# EasyEDA schematic Power Supply.json
TITLE: New Schematic; REV: 1.0; Date: 2018-09-01; Sheet: 1/1; Drawn By: tim.savage
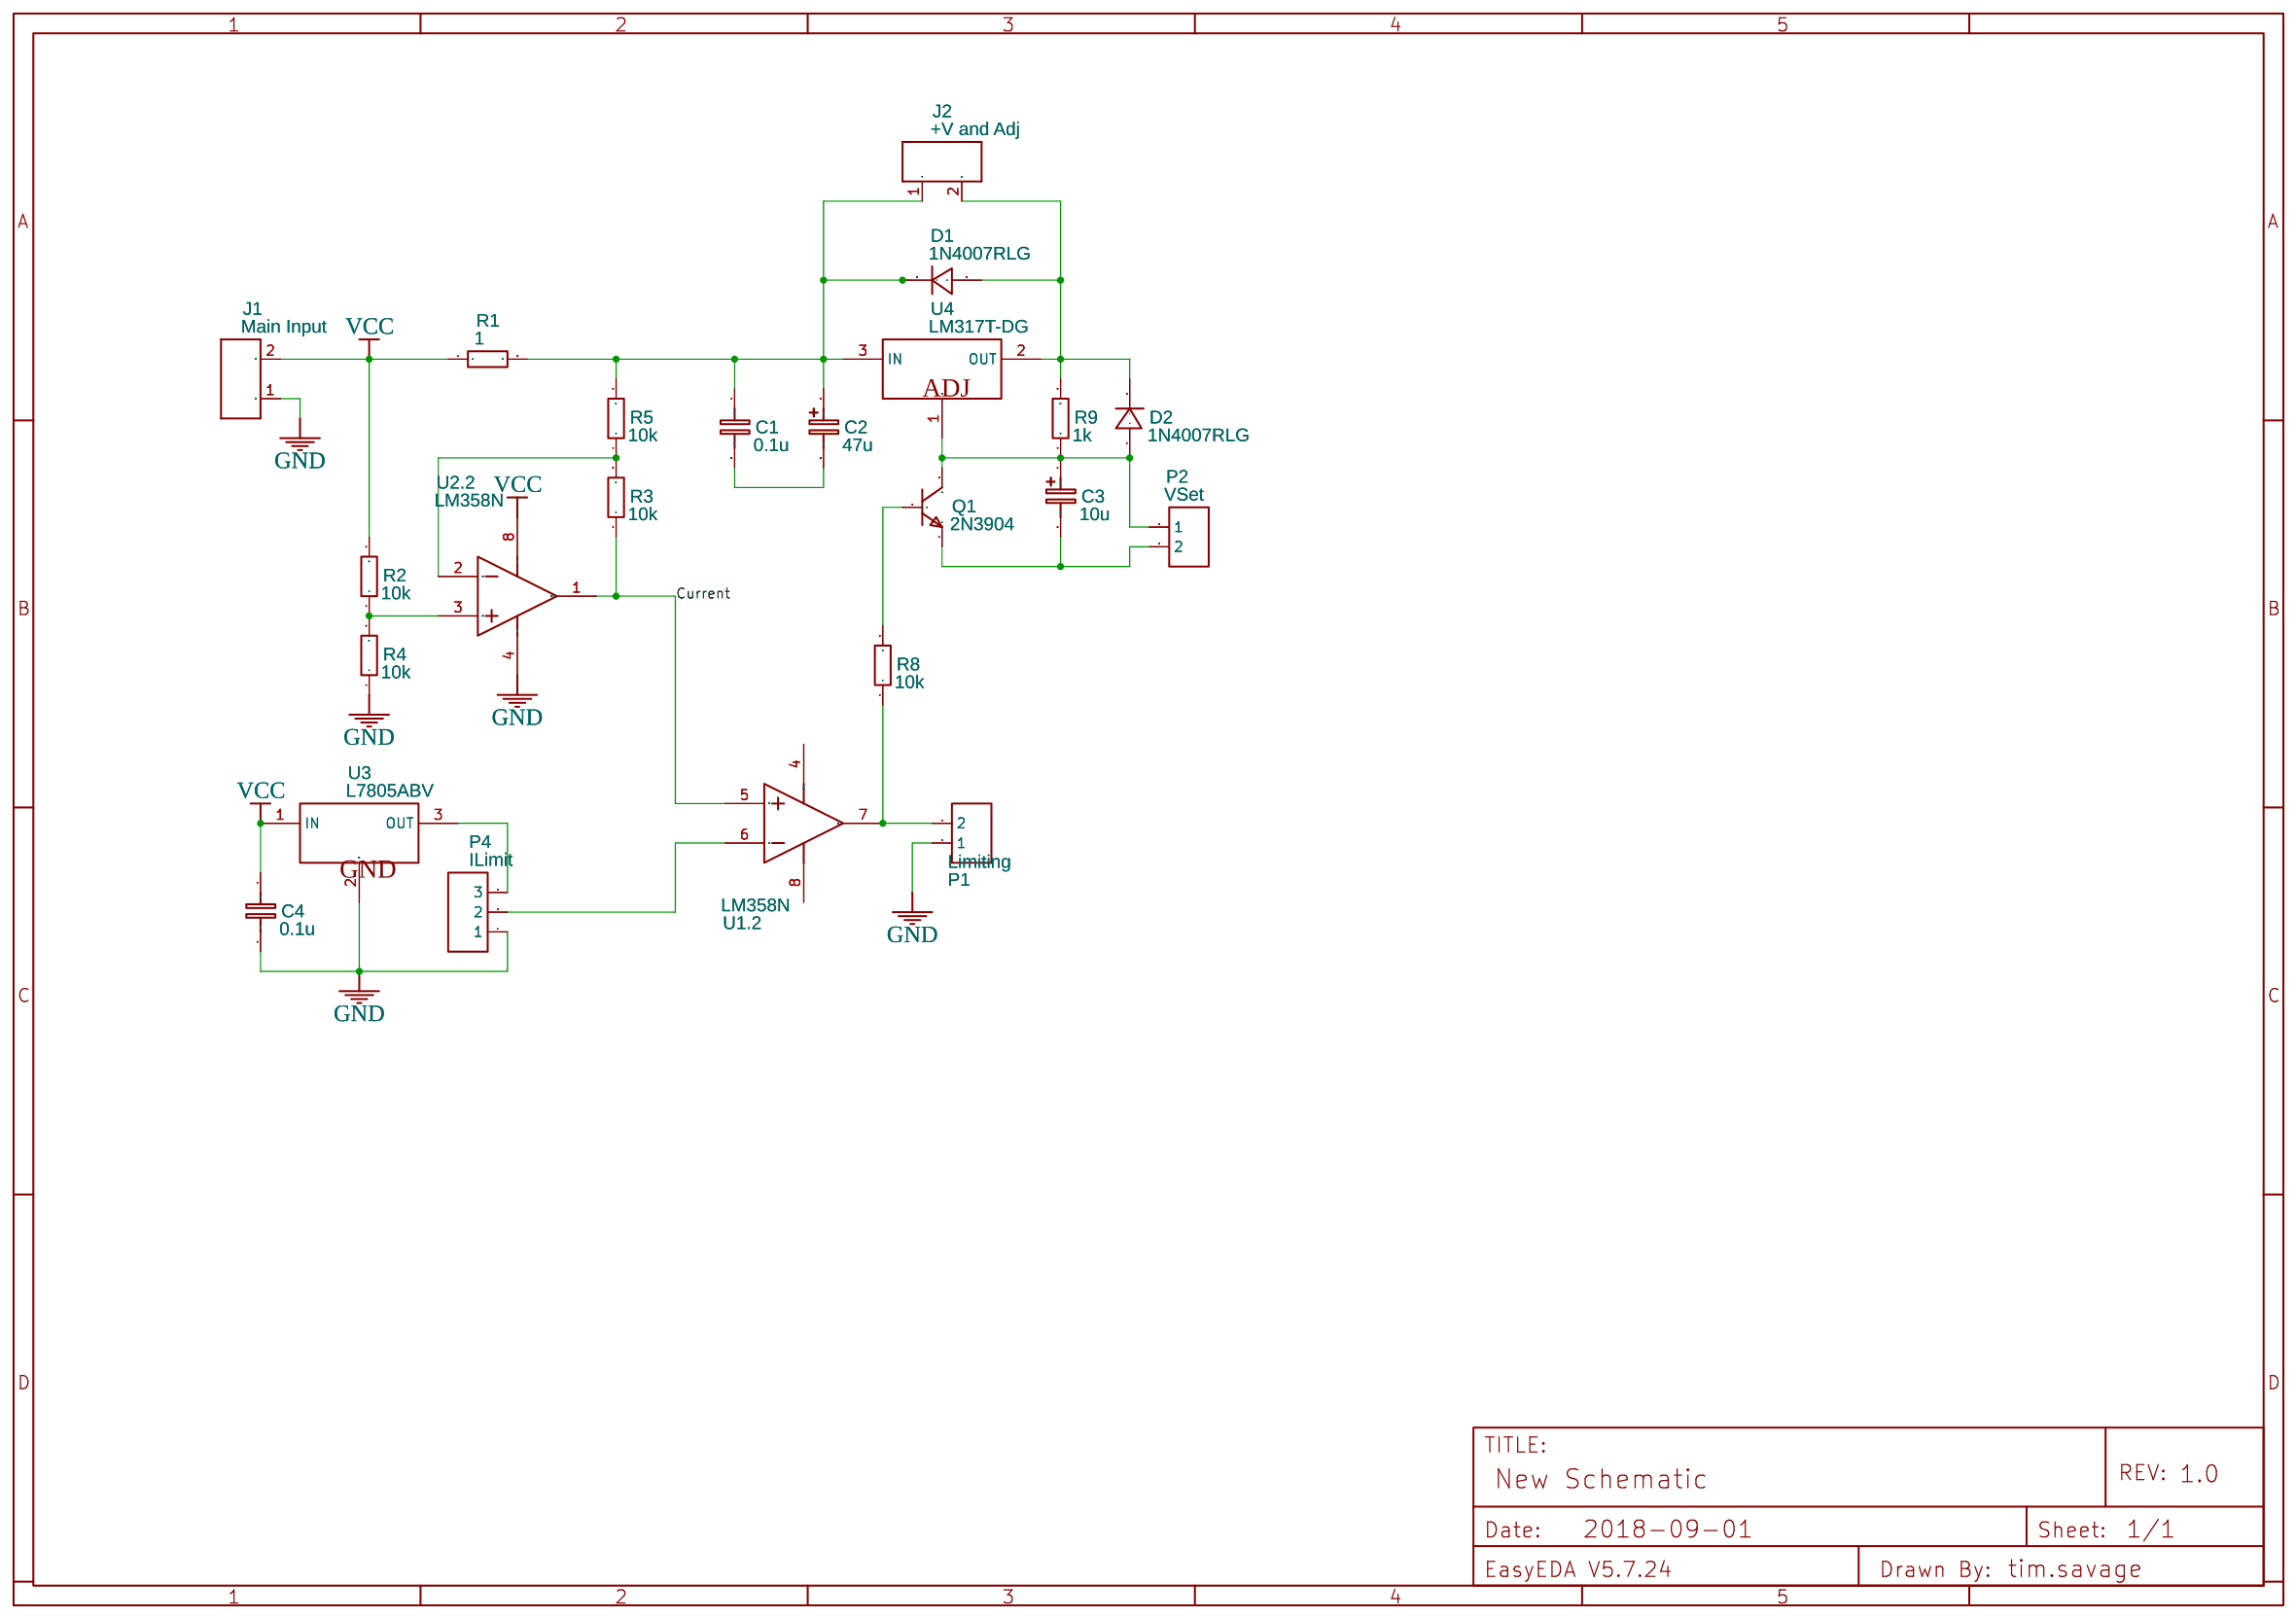
[diagram p0: schematic sheet]

## Parts
C1  0.1u  [RAD-0.1]
C2  47u  [CAP-D3.0XF1.5]
C3  10u  [CAP-D3.0XF1.5]
C4  0.1u  [RAD-0.1]
D1  1N4007RLG  [DO-41]
D2  1N4007RLG  [DO-41]
J1  Main Input  [H2-5.0-10.5X8.0MM]
J2  +V and Adj  [H2-5.0-10.5X8.0MM]
P1  Limiting  [HDR-1X2/2.54]
P2  VSet  [HDR-1X2/2.54]
P4  ILimit  [HDR-3X1/2.54]
Q1  2N3904  [TO-92(TO-92-3)]
R1  1  [AXIAL-0.3]
R2  10k  [AXIAL-0.3]
R3  10k  [AXIAL-0.3]
R4  10k  [AXIAL-0.3]
R5  10k  [AXIAL-0.3]
R8  10k  [AXIAL-0.3]
R9  1k  [AXIAL-0.3]
U1  LM358N  [DIP8]  (section 2)
U2  LM358N  [DIP8]  (section 2)
U3  L7805ABV  [TO-220(TO-220-3)]
U4  LM317T-DG  [TO-220(TO-220-3)]

## Library data of the parts
C1 C4 = Cap_RAD-0.1_EU: Manufacturer Part: ?
C2 C3 = Cap_Electrolytic(TH)_D3.0XF1.5_EU: Contributor: EasyEDA; Manufacturer Part: ?
D1 D2 = -: Supplier Part: C53568; Supplier: LCSC; Manufacturer: ON; image: //image.lceda.cn/szlcsc/C53568.jpg
J1 J2 = -: Screw Terminal; Manufacturer Part: ?
P1 P2 = -: Supplier Part: C49661; Supplier: LCSC; Manufacturer: BOOMELE; Manufacturer Part: 2.54-1*2PFemale; image: //image.lceda.cn/szlcsc/C49661.jpg
P4 = -: Supplier Part: C49257; Supplier: LCSC; Manufacturer: BOOMELE; Manufacturer Part: Header2.54mm 1*3P; image: //image.lceda.cn/szlcsc/C49257.jpg
Q1 = -: Supplier Part: C118538; Supplier: LCSC; Manufacturer: SEMTECH
R1-R5 R8 R9 = Res_AXIAL-0.3(1/8W)_EU: Manufacturer Part: ?
U1 = -: Low Power Dual Operational Amplifier, 8-pin MDIP; Manufacturer Part: ?
U2 = -: Low Power Dual Operational Amplifier, 8-pin MDIP; subpart_no: 2; Manufacturer Part: ?
U3 = -: Supplier Part: C16807; Supplier: LCSC; Manufacturer: STMicroelectronics; image: //image.lceda.cn/szlcsc/C16807.jpg
U4 = -: Supplier Part: C18718; Supplier: LCSC; Manufacturer: STMicroelectronics; image: //image.lceda.cn/szlcsc/C18718.jpg

## Nets
GND: C4.2 J1.1 P1.1 P4.1 R4.1 U2.4(GND) U3.2(GND)
VCC: C4.1 J1.2 R1.1 R2.2 U2.8(V+) U3.1(IN)
Current: R3.1 U1.5(INB+) U2.1(OUTA)
Net-(C1-1): C1.1 C2.1 D1.2(-) J2.1 R1.2 R5.2 U4.3(IN)
Net-(C1-2): C1.2 C2.2
Net-(C3-1): C3.1 D2.1(+) P2.1 Q1.3(C) R9.1 U4.1(ADJ)
Net-(C3-2): C3.2 P2.2 Q1.1(E)
Net-(D1-1): D1.1(+) D2.2(-) J2.2 R9.2 U4.2(OUT)
Net-(P1-2): P1.2 R8.1 U1.7(OUTB)
Net-(P4-2): P4.2 U1.6(INB-)
Net-(P4-3): P4.3 U3.3(OUT)
Net-(Q1-2): Q1.2(B) R8.2
Net-(R2-1): R2.1 R4.2 U2.3(INA+)
Net-(R3-2): R3.2 R5.1 U2.2(INA-)

Not connected (* = marked no-connect by the designer): U1 4(GND) 8(V+)
